# Altium schematic sheet SmartScale.SchDoc
size A4
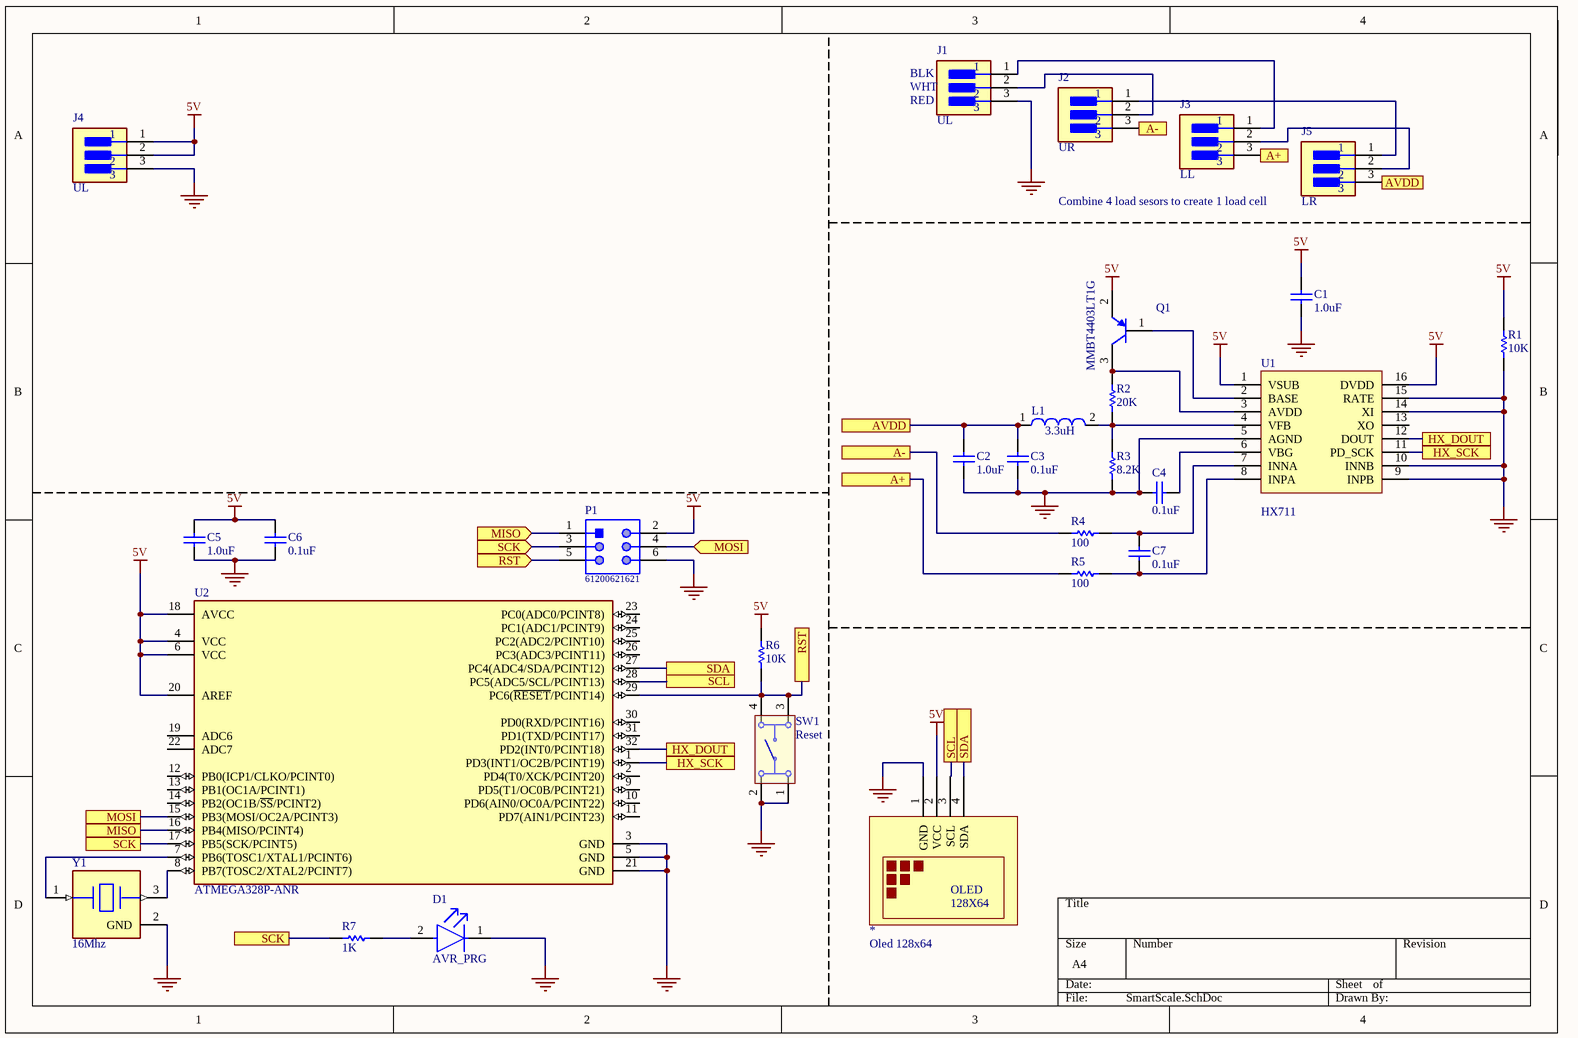
[diagram p0: SmartScale.SchDoc]

## Parts
*  Oled 128x64  [OLED 128X64]
C1  1.0uF  [Cap_0805]
C2  1.0uF  [Cap_0805]
C3  0.1uF  [Cap_0805]
C4  0.1uF  [Cap_0805]
C5  1.0uF  [Cap_0805]
C6  0.1uF  [Cap_0805]
C7  0.1uF  [Cap_0805]
D1  AVR_PRG  [led_0805]
J1  UL  [CONN_1X3_SMD]
J2  UR  [CONN_1X3_SMD]
J3  LL  [CONN_1X3_SMD]
J4  UL  [CONN_1X3_SMD]
J5  LR  [CONN_1X3_SMD]
L1  3.3uH  [SMD 0805_A]
P1  61200621621  [BoxHeader_2*6]
Q1  MMBT4403LT1G  [DIOD-SOT23-3_V]
R1  10K  [Res_0805]
R2  20K  [Res_0805]
R3  8.2K  [Res_0805]
R4  100  [Res_0805]
R5  100  [Res_0805]
R6  10K  [Res_0805]
R7  1K  [Res_0805]
SW1  Reset  [Button_smd]
U1  HX711  [TSOP16]
U2  ATMEGA328P-ANR  [ATMEGA328P_TQFP]
Y1  16Mhz  [Resonator_16Mhz]

## Ports
A+, A-, AVDD, HX_DOUT, HX_SCK, MISO, MISO (in), MOSI, MOSI (in), RST, RST (in), SCK, SCK (in), SCL, SDA

## Nets
5V: *.2(VCC) C1.2 C5.2 C6.2 J4.1 J4.2 P1.2 Q1.2(E) R1.2 R6.2 U1.1(VSUB) U1.16(DVDD) U2.4(VCC) U2.6(VCC) U2.18(AVCC) U2.20(AREF)
GND: *.1(GND) C1.1 C2.1 C3.1 C4.1 C5.1 C6.1 D1.1(C) J1.3 J4.3 P1.6 R1.1 R3.1 SW1.1 SW1.2 U1.5(AGND) U1.9(INPB) U1.10(INNB) U1.14(XI) U1.15(RATE) U2.3(GND) U2.5(GND) U2.21(GND) Y1.2(GND)
A+: J3.3 R5.1 ; port A+
A-: J2.3 R4.1 ; port A-
AVDD: C2.2 C3.2 J5.3 L1.1 ; port AVDD
HX_DOUT: U1.12(DOUT) U2.32(PD2(INT0/PCINT18)) ; port HX_DOUT
HX_SCK: U1.11(PD_SCK) U2.1(PD3(INT1/OC2B/PCINT19)) ; port HX_SCK
MISO: P1.1 U2.16(PB4(MISO/PCINT4)) ; port MISO
MOSI: P1.4 U2.15(PB3(MOSI/OC2A/PCINT3)) ; port MOSI
RST: P1.5 R6.1 SW1.3 SW1.4 U2.29(PC6(~{RESET}/PCINT14)) ; port RST
SCK: P1.3 R7.2 U2.17(PB5(SCK/PCINT5)) ; port SCK
SCL: *.3(SCL) U2.28(PC5(ADC5/SCL/PCINT13)) ; port SCL
SDA: *.4(SDA) U2.27(PC4(ADC4/SDA/PCINT12)) ; port SDA
NetC4_2: C4.2 U1.6(VBG)
NetC7_1: C7.1 R5.2 U1.8(INPA)
NetC7_2: C7.2 R4.2 U1.7(INNA)
NetD1_2: D1.2(A) R7.1
NetJ1_1: J1.1 J3.1
NetJ1_2: J1.2 J2.2
NetJ2_1: J2.1 J5.1
NetJ3_2: J3.2 J5.2
NetL1_2: L1.2 R2.1 R3.2 U1.4(VFB)
NetQ1_1: Q1.1(B) U1.2(BASE)
NetQ1_3: Q1.3(C) R2.2 U1.3(AVDD)
NetU2_7: U2.7(PB6(TOSC1/XTAL1/PCINT6)) Y1.1(Input)
NetU2_8: U2.8(PB7(TOSC2/XTAL2/PCINT7)) Y1.3(Output)

Not connected (* = marked no-connect by the designer): U1 13(XO); U2 2(PD4(T0/XCK/PCINT20)) 9(PD5(T1/OC0B/PCINT21)) 10(PD6(AIN0/OC0A/PCINT22)) 11(PD7(AIN1/PCINT23)) 12(PB0(ICP1/CLKO/PCINT0)) 13(PB1(OC1A/PCINT1)) 14(PB2(OC1B/~{SS}/PCINT2)) 19(ADC6) 22(ADC7) 23(PC0(ADC0/PCINT8)) 24(PC1(ADC1/PCINT9)) 25(PC2(ADC2/PCINT10)) 26(PC3(ADC3/PCINT11)) 30(PD0(RXD/PCINT16)) 31(PD1(TXD/PCINT17))

## Notes on the sheet
- RED
- WHT
- BLK
- Combine 4 load sesors to create 1 load cell
- (in symbol Oled 128x64) OLED; 128X64

## Library data of the parts
C1 C2 C5 = Cap_1.0uf: Manufacturer: Kemet; Part Number: C0805C105K4PACTU
C3 C4 C6 C7 = Cap_0.1uf_0805: Cap Ceramic 100nF 100V X7R 10% Pad SMD 0805 +125°C Automotive T/R; Height: 1.25mm; Ratings: AEC-Q200; Packaging: Tape and Reel; Case Code (Metric): 2012; Thickness: 0.057inch; Depth: 1.25mm; Radiation Hardening: No; Mount: Surface Mount; Dielectric: X7R; Voltage Rating (DC): 100V; Min Operating Temperature: -55°C; Case/Package: 0805; Voltage Rating: 100V; Lead Free: Lead Free; REACH SVHC: No SVHC; Case Code (Imperial): 0805; Capacitance: 100nF; Max Operating Temperature: 125°C; Termination: SMD/SMT; Composition: Ceramic; Width: 0.049inch; Package Quantity: 1; Tolerance: 10%; Length: 2mm; Weight: 0.000194oz
D1 = Led_0805: LED BLUE CLEAR CHIP SMD; Reverse Voltage: 5V; Lens Color: Colorless; Forward Voltage: 3.8V; Number of Elements: 1; Forward Current: 20mA; Power Dissipation: 76mW; Luminous Intensity: 180mcd; Lens Style: Diffused; Dominant Wavelength: 475nm; Viewing Angle: 130°; Wavelength: 468nm; Number of Pins: 2; Color: Blue; Lens Transparency: Clear; Illumination Color: Blue; Test Current: 20mA; Max Operating Temperature: 80°C; Package Quantity: 1; Case/Package: 0805; Packaging: Tape and Reel; Case Code (Metric): 2012; Case Code (Imperial): 0805; Number of LEDs: 1; Width: 1.25mm; Lead Free: Lead Free; Length: 2mm; Depth: 1.25mm; Mount: Surface Mount; Height: 0.8mm; Radiation Hardening: No; Min Operating Temperature: -20°C
J1-J5 = CONN_1X3_SMD: CONN HEADER SMD R/A 3POS 1.25MM; Manufacturer: Molex; Manufacturer Part Number: 53261-0371; Number Of Contacts: 3; Conn Orientation: Right Angle; Current Rating: 1A; Voltage Rating: 125V; Conn Gender: Male; Category: Conn; Automotive: No; Footprint Url: https://www.molex.com/pdm_docs/sd/532610371_sd.pdf; Height: 3.6mm; Number Of Rows: 1; Temperature Range Low: -40°C; Package: 0; Octopart: https://octopart.com/53261-0371-molex-655314; ComponentLink2Description: Datasheet; Lead Free: Yes; Ambient Temperature Range Low: -40°C; Device Class L3: unset; Mouser Description: 1.25mm (.049") Pitch PicoBlade Header, Surface Mount, Right Angle, Lead-free, 3 Circuits; Digikey Description: CONN HEADER SMD R/A 3POS 1.25MM; Device Class L2: Headers and Wire Housings; Contact Material: Tin,Nickel; Ambient Temperature Range High: +105°C; ComponentLink2URL: https://www.molex.com/webdocs/datasheets/pdf/en-us/0532610371_PCB_HEADERS.pdf; Pitch: 1.25mm; Temperature: -40°C to +105°C; RoHS: TRUE; Device Class L1: Connectors; Temperature Range High: +105°C
L1 = COIL_3.3uH_0805: Power Multilayer Inductor WE-PMI, L=3.30 µH; PartNumber: 74479775233; Manufacturer: Wuerth Elektronik; Inductance: 3.30 ÂµH; ComponentLink1Description: Manufacturer URL; ComponentLink2Description: Datasheet; ComponentLink1URL: http://www.we-online.com; ComponentLink2URL: http://katalog.we-online.de/kataloge/eisos/media/pdf/74479775233.pdf; PackageReference: SMD 0805_A
P1 = BoxHeader_2*6: Male Box Header WR-BHD, THT, Vertical, pitch 2.54 mm, 6 pins; Manufacturer: Wurth Elektronik; Withstanding Voltage: 500VAC; Working Voltage: 250VAC; Pin Number: 6; Pitch: 2.54mm; Contact Resistance: 20mOhm; Part Number: 61200621621; Manufacturer URL: http://www.we-online.de; Published Date: August2018; Orientation: Vertical; Publisher: WurthElektronik; Operating Temperature: -40to125degC; Datasheet URL: https://katalog.we-online.de/em/datasheet/6120xx21621.pdf; Mounting Technology: THT; Packaging: Tray; Gender: Male; Package Reference: 61200621621
Q1 = BJT: Switching Transistor, PNP Silicon, 3-Pin SOT-23, Pb-Free, Tape and Reel; Manufacturer: On Semiconductor; fT Min (MHz): 200; IC Continuous (A): -0.6; ComponentLink1URL: http://www.onsemi.com/; ComponentLink2URL: http://www.onsemi.cn/pub_link/Collateral/MMBT4403LT1-D.PDF; PackageVersion: Rev. AP, 11/2009; ComponentLink1Description: Manufacturer URL; PackageDescription: 3-Pin Small Outline Transistor, Body 2.92 x 1.3 mm, Pitch 0.95 mm; Polarity: PNP; ComponentLink3Description: Package Specification; DatasheetVersion: Rev. 12; Mounting Technology: Surface Mount; PackageReference: SOT-23-3-318-08; ComponentLink3URL: http://www.onsemi.cn/pub_link/Collateral/318-08.PDF; Packing: Tape and Reel; PartNumber: MMBT4403LT1G; RoHS: TRUE; ComponentLink2Description: Datasheet
R1 R6 = Res_10k_0805: Chip Resistor, 10 KOhm, +/- 1%, 0.125 W, -55 to 155 degC, 0805 (2012 Metric), RoHS, Tape and Reel; Manufacturer: Yageo; Voltage Rating: 150 V; Mount: Surface Mount; ComponentLink1Description: Manufacturer URL; ComponentLink2URL: http://www.yageo.com/documents/recent/PYu-RC_Group_51_RoHS_L_04.pdf; Pins: 2; Length: 2 mm; Min Operating Temperature: -55 degC; Height: 0.5 mm; Mounting Technology: Surface Mount; RoHSCompliant: true; REACH SVHC: No SVHC; ComponentLink1URL: http://www.yageo.com/; Max Operating Temperature: 155 degC; PackageReference: 0805; DatasheetVersion: Rev. 4, 02/2016; Package Quantity: 5000; Packaging: Tape and Reel; ComponentLink2Description: Datasheet; PackageDescription: 2-Pin Surface Mounted Device, Body 2 x 1.25 mm
R2 = RES_20K: Part Number: CRCW080520K0JNEA; Manufacturer: Vishay Dale
R3 = Res_8.2K: Manufacturer: Panasonic; Part Number: ERJ-6GEYJ822V
R4 R5 = Res_100: Manufacturer: Vishay Dale; Part Number: CRCW0805100RFKEA
R7 = res_1k_0805: Chip Resistor, 1 KOhm, +/- 1%, 125 mW, -55 to 155 degC, 0805 (2012 Metric), RoHS, Tape and Reel; Manufacturer: Yageo; Temperature Coefficient: 100ppm/degreesC; Voltage Rating (DC): 150V; Max Power Dissipation: 125mW; Resistance: 1KOhm; Number of Pins: 2; Number of Terminations: 2; Datasheet URL: http://www.yageo.com/NewPortal/yageodocoutput?fileName=/pdf/R-Chip/PYu-RC_Group_51_RoHS_L_5.pdf; Length: 0.079inch; Package Description: 2-Pin Surface Mounted Device, Body 2 x 1.25 mm; Depth: 1.25mm; Height: 0.024inch; Military Standard: Not; Case/Package: 0805; Package Reference: 0805; RoHSCompliant: true; Lead Free: LeadFree; Packaging: TapeandReel; Package Quantity: 1; Datasheet Version: Rev. 5, 10/2016; Tolerance: 1%; Min Operating Temperature: -55degC; Voltage Rating: 150V; Composition: ThickFilm; Case Code (Imperial): 0805; Power Rating: 125mW; Width: 0.049inch; Case Code (Metric): 2012; Manufacturer URL: http://www.yageo.com/; Max Operating Temperature: 155degC; REACH SVHC: Unknown; Termination: SMD/SMT
SW1 = Button_smd: WS-TASV SMD Tact Switch 6X6 mm; PartNumber: 430451025836; Manufacturer: Wuerth Elektronik; NoPins: 04; ComponentLink1Description: Manufacturer URL; ComponentLink1URL: http://www.we-online.com; ComponentLink2Description: Datasheet; ComponentLink2URL: http://katalog.we-online.de/em/datasheet/4304x1.pdf; PackageReference: 430451025836
U1 = HX711: ADC for load cells; ComponentLink1Description: buying; ComponentLink1URL: https://ozdisan.com/entegre-devreler-ics/interface-entegreleri/analogtan-digitale-donusturucu-entegreler-adc/HX711
U2 = ATMEGA328P_TQFP: IC MCU 8BIT 32KB FLASH 32TQFP; Peripherals: Brown-out Detect/Reset; Frequency: 20MHz; Oscillator Type: Internal; Number of I/Os: 23; Core Architecture: AVR; Interface: I2C; Memory Type: FLASH; Max Operating Temperature: 105°C; Memory Size: 32KB; Case/Package: TQFP; Number of Pins: 32; Min Operating Temperature: -40°C; Packaging: Tape and Reel
Y1 = Resonator_16Mhz: CERAMIC RES 16.0000MHZ 15PF SMD; Manufacturer Part Number: CSTNE16M0V530000R0; Manufacturer: Murata; Tolerance: 0.5%; Stability: 0.3%; Esr: 40Ω; Lead Free: Yes; ComponentLink2URL: https://www.murata.com/en-sg/products/productdata/8801162231838/SPEC-CSTNE16M0V530000R0.pdf?1545967809000; ComponentLink2Description: Datasheet; Device Class L3: Crystals; Load Capacitance: 15pF; Temperature: -40°C to +85°C; Temperature Range High: +85°C; Series: CSTNE_V; Mouser Description: Ceramic Resonator 16MHz ±0.5% (Tol) ±0.3% (Stability) 15pF 40Ohm 3-Pin CSMD T/R; Automotive: No; RoHS: TRUE; Device Class L2: Crystals / Oscillators; Frequency: 16MHz; Package: 0; Category: Crys; Device Class L1: Passive Components; Height: 1mm; Temperature Range Low: -40°C; Digikey Description: CERAMIC RES 16.0000MHZ 15PF SMD; Octopart: https://octopart.com/cstne16m0v530000r0-murata-91406924